# EAGLE design INA220 Current Sensor Breakout REV A (EAGLE 9.6.2)
AUTHOR: Nathan Cheek; CONTACT: ncheek@gatech.edu; REV: A
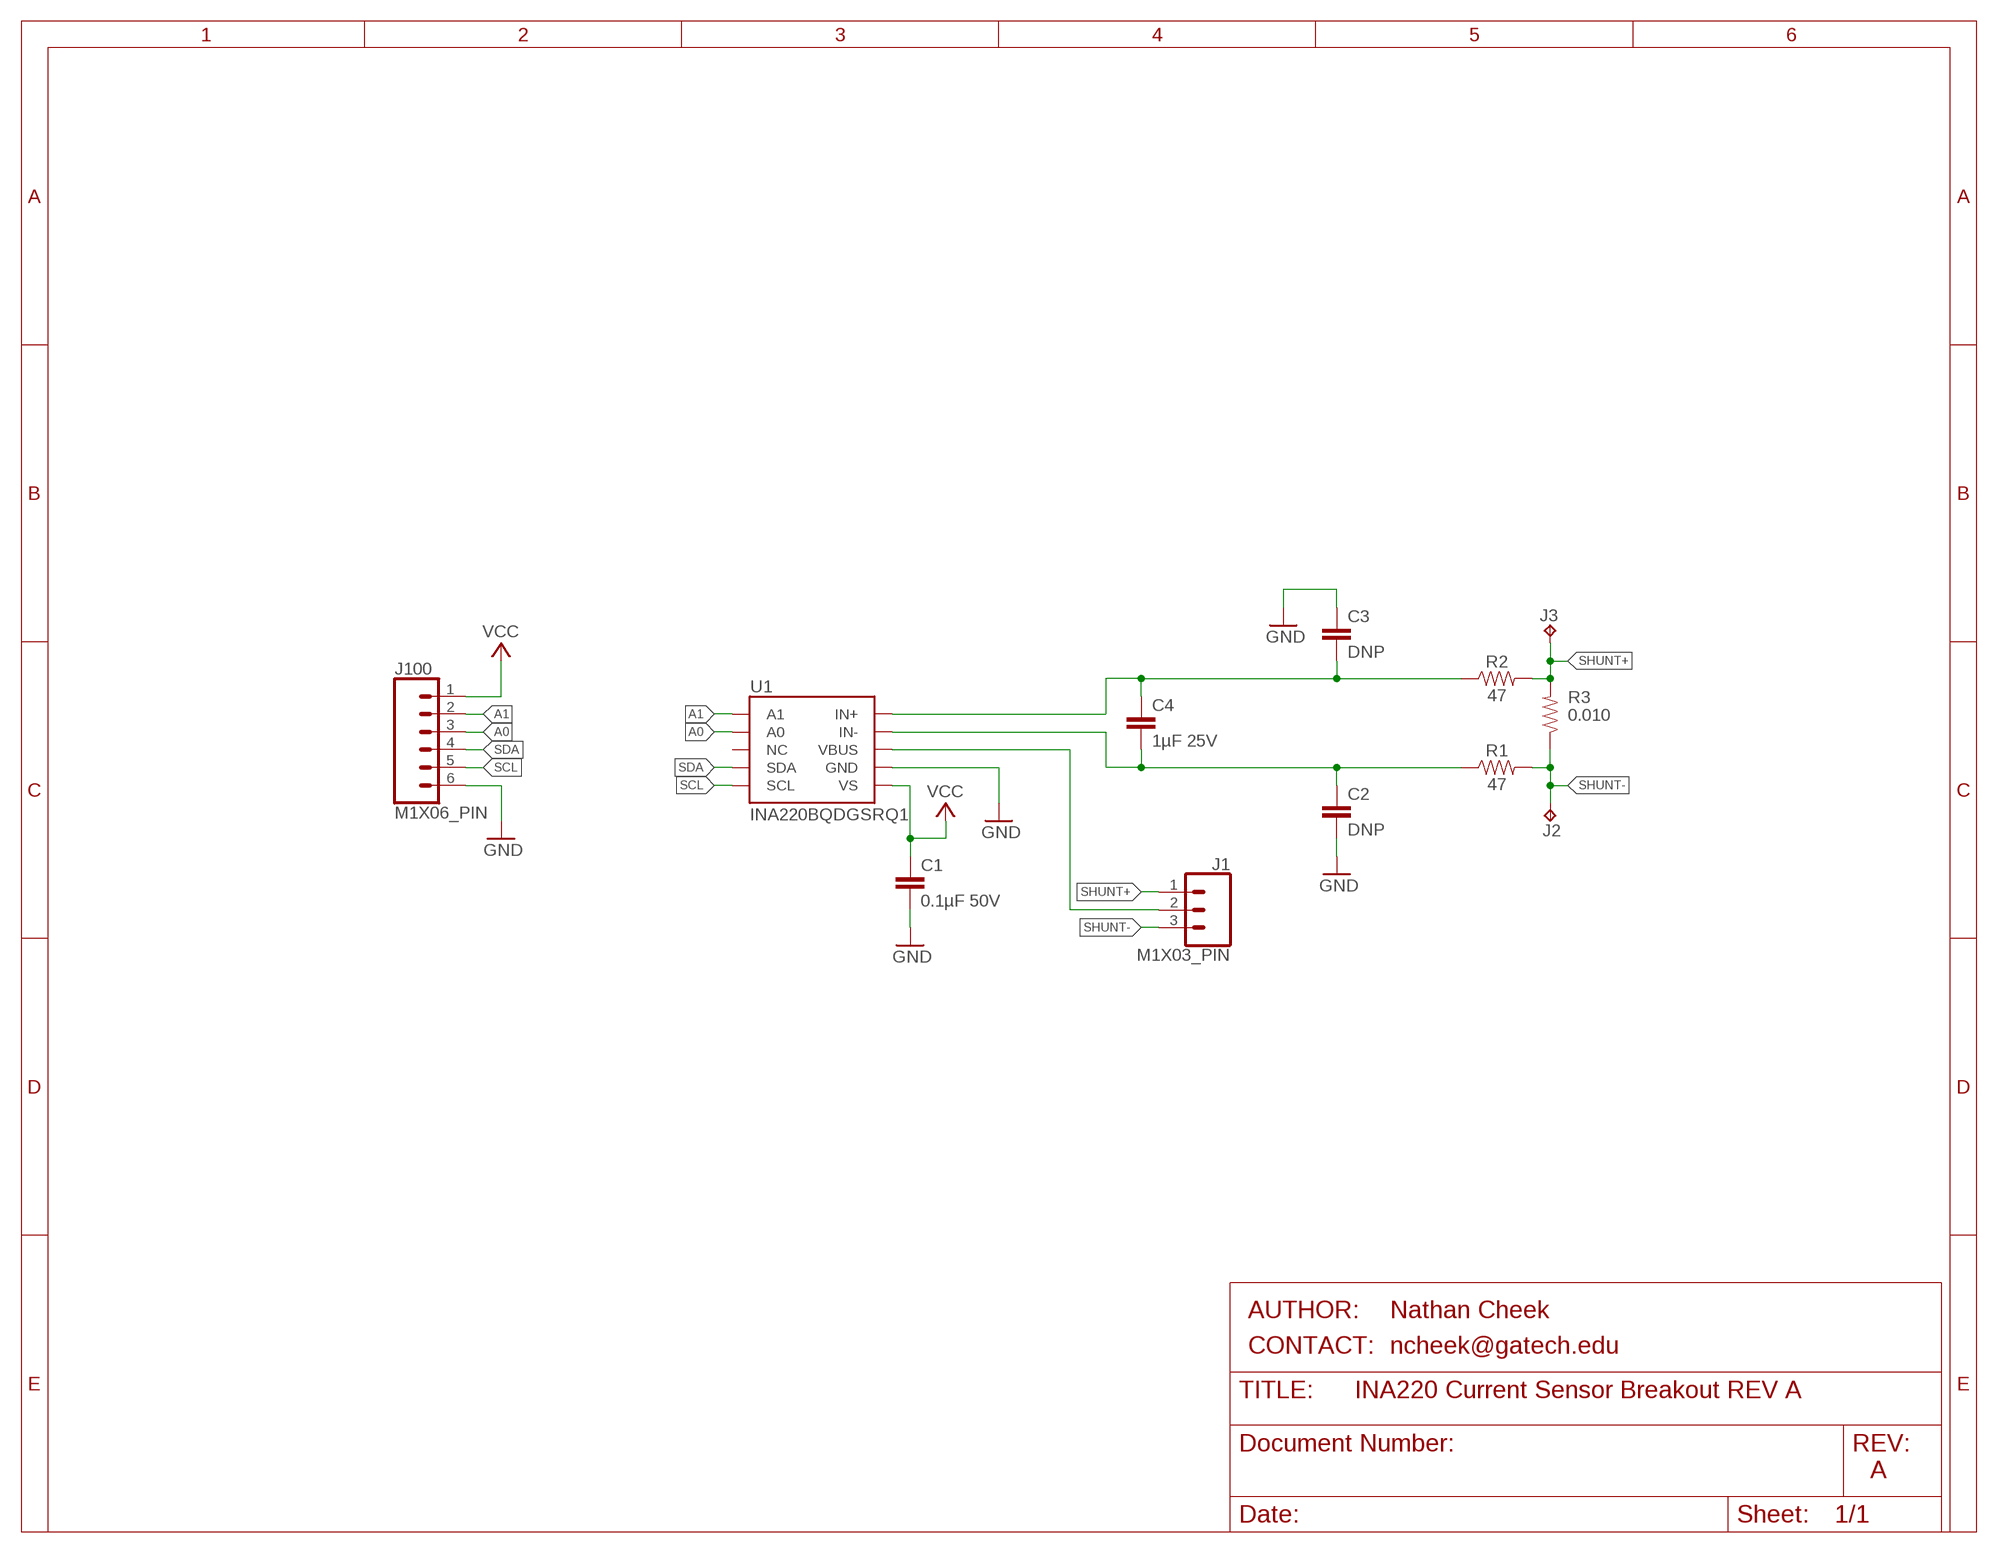
[diagram p0: schematic, sheet 1]

## Parts
C1  0.1µF 50V  CAPACITOR_YAGEO_CC0603_X7R_0.1UF_50V_±10%  [C0603]
C2  DNP  CAPACITOR_YAGEO_CC0603_X7R_DNP_50V_±10%  [C0603]
C3  DNP  CAPACITOR_YAGEO_CC0603_X7R_DNP_50V_±10%  [C0603]
C4  1µF 25V  CAPACITOR_YAGEO_CC0603_X7R_1UF_25V_±10%  [C0603]
J1  M1X03_PIN  [1X03]
J2  BANANA_KEYSTONE_575-4  [575]
J3  BANANA_KEYSTONE_575-4  [575]
J100  M1X06_PIN  [1X06]
R1  47  RESISTOR_YAGEO_RC0603FR_47  [R0603]
R2  47  RESISTOR_YAGEO_RC0603FR_47  [R0603]
R3  0.010  RESISTOR_PANASONIC_ERJ-6CWD_0.01  [R0805]
U1  INA220BQDGSRQ1  [VSSOP-10]

## Nets
A0: J100.3 U1.P$2(A0)
A1: J100.2 U1.P$1(A1)
GND: C1.2 C2.1 C3.2 J100.6 U1.P$7(GND)
N$3: J1.2 U1.P$8(VBUS)
N$92: C2.2 C4.1 R1.1 U1.P$9(IN-)
N$93: C3.1 C4.2 R2.1 U1.P$10(IN+)
SCL: J100.5 U1.P$5(SCL)
SDA: J100.4 U1.P$4(SDA)
SHUNT+: J1.1 J3.P$1 R2.2 R3.2
SHUNT-: J1.3 J2.P$1 R1.2 R3.1
VCC: C1.1 J100.1 U1.P$6(VS)
Unconnected: U1.P$3(NC)

## Notes on the sheet
- AUTHOR:
- CONTACT:

## Library data of the parts
C1 = NC-Passives:CAPACITOR_YAGEO_CC0603_X7R_: Yageo CC-series Ceramic Capacitor Package: 0603 Temp Coefficient: X7R Datasheet <https://www.yageo.com/upload/media/product/productsearch/datasheet/mlcc/UPY-GPHC_X7R_6.3V-to-50V_18.pdf>; DIGIKEY: 311-1344-1-ND; MANUFACTURER: YAGEO; MPN: CC0603KRX7R9BB104; OPERATING_TEMP: -55°C ~ 125°C; TEMP_COEFFICIENT: X7R; TOLERANCE: ±10%; VOLTAGE: 50V
C2 C3 = NC-Passives:CAPACITOR_YAGEO_CC0603_X7R_: Yageo CC-series Ceramic Capacitor Package: 0603 Temp Coefficient: X7R Datasheet <https://www.yageo.com/upload/media/product/productsearch/datasheet/mlcc/UPY-GPHC_X7R_6.3V-to-50V_18.pdf>
C4 = NC-Passives:CAPACITOR_YAGEO_CC0603_X7R_: Yageo CC-series Ceramic Capacitor Package: 0603 Temp Coefficient: X7R Datasheet <https://www.yageo.com/upload/media/product/productsearch/datasheet/mlcc/UPY-GPHC_X7R_6.3V-to-50V_18.pdf>; DIGIKEY: 311-1802-1-ND; MANUFACTURER: YAGEO; MPN: CC0603KRX7R8BB105; OPERATING_TEMP: -55°C ~ 125°C; TEMP_COEFFICIENT: X7R; TOLERANCE: ±10%; VOLTAGE: 25V
J1 = NC-Connectors:M1X03; DIGIKEY: S1011EC-03-ND; MANUFACTURER: Sullins; MPN: PRPC003SAAN-RC
J2 J3 = NC-Connectors:BANANA_KEYSTONE_575: Keystone vertical banana jack Product Page <https://www.keyelco.com/category.cfm/Banana-Plugs-Jacks/Banana-Jacks/p/459/id/461/c_id/808>; DIGIKEY: 36-575-4-ND; MANUFACTURER: Keystone Electronics; MPN: 575-4
J100 = NC-Connectors:M1X06; DIGIKEY: S1011EC-06-ND; MANUFACTURER: Sullins; MPN: PRPC006SAAN-RC
R1 R2 = NC-Passives:RESISTOR_YAGEO_RC0603FR_: Yageo RC0603FR Resistor Surface mount 0603 package 0.1W power ±1% tolerance (Jumper<50mΩ) Datasheet <https://www.yageo.com/upload/media/product/productsearch/datasheet/rchip/PYu-RC_Group_51_RoHS_L_10.pdf>; DIGIKEY: 311-47.0HRCT-ND; MANUFACTURER: YAGEO; MPN: RC0603FR-0747RL; TOLERANCE: ±1%
R3 = NC-Passives:RESISTOR_PANASONIC_ERJ-6CWD_: Panasonic ERJ-6CWD Current Sensing Resistor Surface mount 0805 package 0.5W power ±0.5% tolerance Datasheet <https://industrial.panasonic.com/cdbs/www-data/pdf/RDN0000/AOA0000C313.pdf>; DIGIKEY: P124401CT-ND; MANUFACTURER: Panasonic; MOUSER: 667-ERJ-6CWDR010V; MPN: ERJ-6CWDR010V; TOLERANCE: ±0.5%
U1 = NC-IC-Sensing:INA220: Texas Instruments INA220 Current Monitor with I2C Interface INA220A <https://www.ti.com/lit/ds/symlink/ina220.pdf> - Grade A INA220B <https://www.ti.com/lit/ds/symlink/ina220.pdf> - Grade B (higher accuracy and precision INA220BQDGSRQ1 <https://www.ti.com/lit/ds/symlink/ina220-q1.pdf> - Automotive Grade; DIGIKEY: 296-36593-1-ND; MANUFACTURER: Texas Instruments; MPN: INA220BQDGSRQ1

## Board
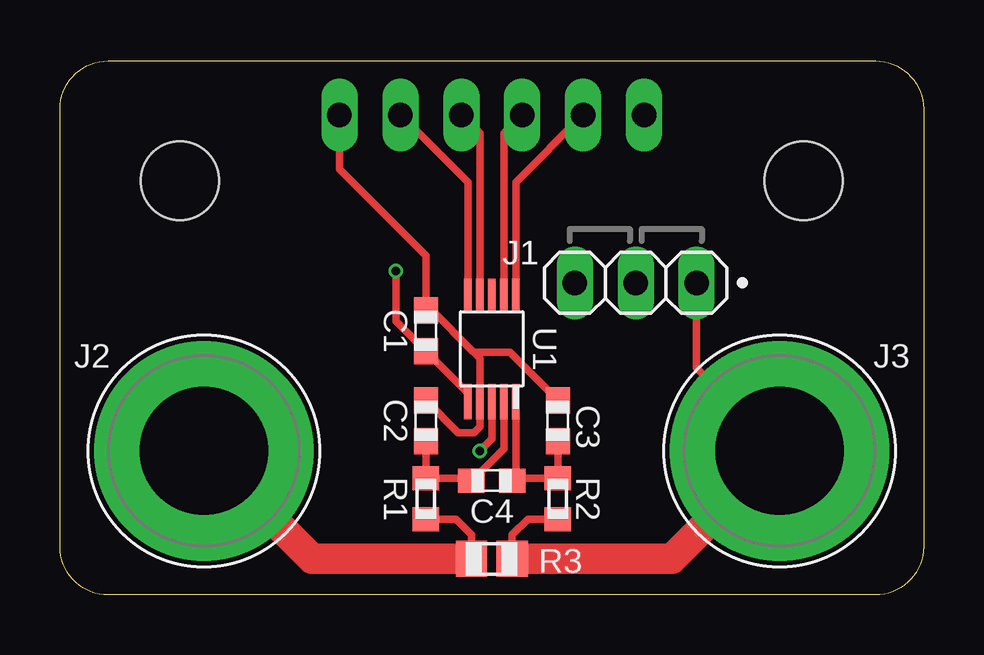
[diagram p1: board, top side]
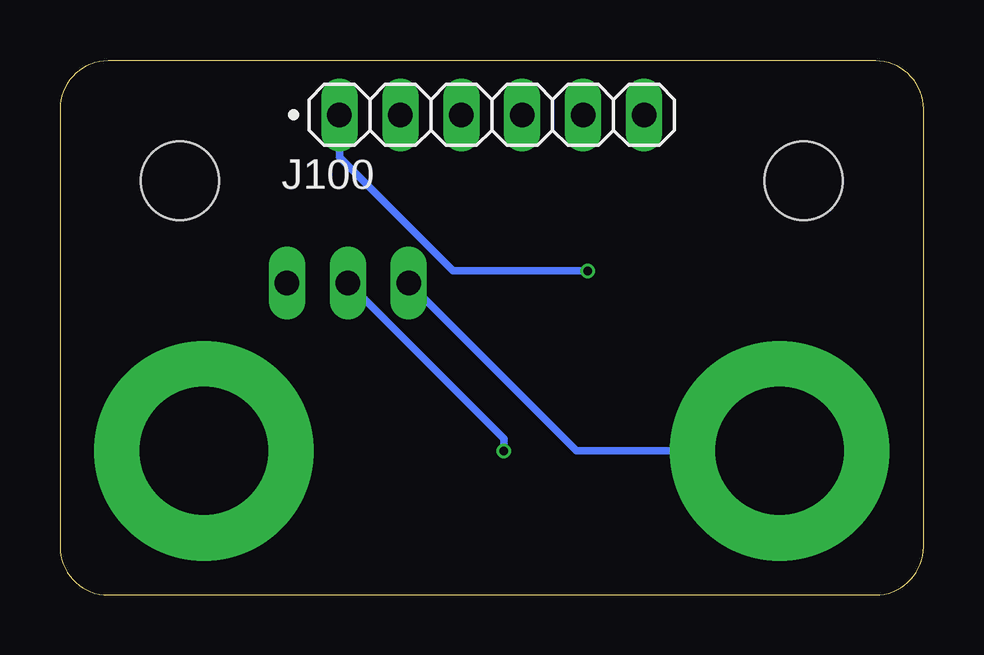
[diagram p2: board, bottom side, seen from below]

Size 36 x 22.25 mm. Coordinates in mm from the lower left corner, seen from the top.
Outline: 36,20.25 36,2 arc-90 34,0 2,0 arc-90 0,2 0,20.25 arc-90 2,22.25 34,22.25 arc-90 36,20.25
Copper layers (1*16): Top 0.035559375mm / dielectric 1.6mm / Bottom 0.035559375mm
Design rules "oshpark-2layer-viatenting": minimum track width 6mil, minimum drill 10mil, track to track 6mil, track to pad 6mil, pad to pad 6mil, via to via 6mil, smd to smd 6mil, copper to edge 15mil, drill to drill 6mil, minimum pad ring 5mil, minimum via ring 5mil, stop-mask expansion 2.5mil, vias tented up to drill 15mil, thermal gap 10mil
Holes 3.26 mm at 31,17.25 5,17.25
tRestrict: area 27.2,13.5 to 34.8,21; area 1.2,13.5 to 8.8,21
bRestrict: area 27.2,13.5 to 34.8,21; area 1.2,13.5 to 8.8,21

### Footprints (pad centres in the part's own frame; a part is rotated, then mirrored left to right if it is on the bottom)
C0603 = smd 1.1 x 1: 1 -0.85,0; 2 0.85,0
1X03 = drill 1.016 long: 1 -2.54,0; 2 0,0; 3 2.54,0
575 = drill 5.334 pad 9.144: P$1 0,0
1X06 = drill 1.016 long: 1 -6.35,0; 2 -3.81,0; 3 -1.27,0; 4 1.27,0; 5 3.81,0; 6 6.35,0
R0603 = smd 1 x 1.1: 1 -0.85,0; 2 0.85,0
R0805 = smd 1.3 x 1.5: 1 -0.85,0; 2 0.85,0
VSSOP-10 = smd 0.3 x 1.45: P$1 -1,-2.2; P$2 -0.5,-2.2; P$3 0,-2.2; P$4 0.5,-2.2; P$5 1,-2.2; P$6 1,2.2; P$7 0.5,2.2; P$8 0,2.2; P$9 -0.5,2.2; P$10 -1,2.2

### Placement (x,y rotation side)
C1  15.25,11 90 top
C2  15.25,7.25 270 top
C3  20.75,7.25 90 top
C4  18,4.75 0 top
J1  24,13 180 top
J2  6,6 0 top
J3  30,6 0 top
J100  18,20 0 bottom
R1  15.25,4 270 top
R2  20.75,4 270 top
R3  18,1.5 0 top
U1  18,10.25 180 top

### Tracks (layer width: path | path; a pad name or v marks a point on that pad's centre or on a via)
A0
  Top 0.305: J100.3 18.5,19.23 U1.P$2
A1
  Top 0.305: J100.2 19,17.19 U1.P$1
GND
  Top 0.305: 17.25,10.1 17.18,10.18 15.5,11.85 C1.2 15.25,14.13 11.65,17.73 J100.6 | C2.1 16.6,6.75 17.25,6.75 17.5,7 U1.P$7 17.5,9.85 17.25,10.1 | 17.25,10.1 18.75,10.1 C3.2
N$3  (via drill 0.35)
  Top 0.305: v17.5,6 18,6.5 U1.P$8
  Bottom 0.305: J1.2 17.5,6.5 v17.5,6
N$92
  Top 0.305: C2.2 R1.1 17.05,4.85 C4.1 17.09,4.68 18.5,6.08 U1.P$9
N$93
  Top 0.305: C3.1 R2.1 18.95,4.85 C4.2 19,4.9 U1.P$10
SCL
  Top 0.305: J100.5 17,17.19 U1.P$5
SDA
  Top 0.305: J100.4 17.5,19.23 U1.P$4
SHUNT+
  Top 0.305: R2.2 19.5,3.15 18.85,2.5 R3.2 | J3.P$1 26.54,9.46 J1.1
  Top 1.27: R3.2 25.5,1.5 J3.P$1
SHUNT-
  Top 0.305: R1.2 16.5,3.15 17.15,2.5 R3.1
  Top 1.27: R3.1 10.5,1.5 J2.P$1
  Bottom 0.305: J1.3 14.46,6 J2.P$1
VCC  (via drill 0.35)
  Top 0.305: v14,13.5 14,11.4 C1.1 17,8.4 U1.P$6
  Bottom 0.305: v14,13.5 19.62,13.5 24.35,18.23 J100.1

### Text on the board
tDocu: GND | SCL | SDA | A0 | A1 | VCC | SHUNT- | SHUNT+ | - | VBUS / Sense | +
bDocu: INA220 Current Sensor / Breakout Board REV A | ncheek@gatech.edu / Nathan Cheek | SN: